# Altium schematic sheet IQ_AMP.SchDoc
size A; SheetNumber: 5; SheetTotal: 6
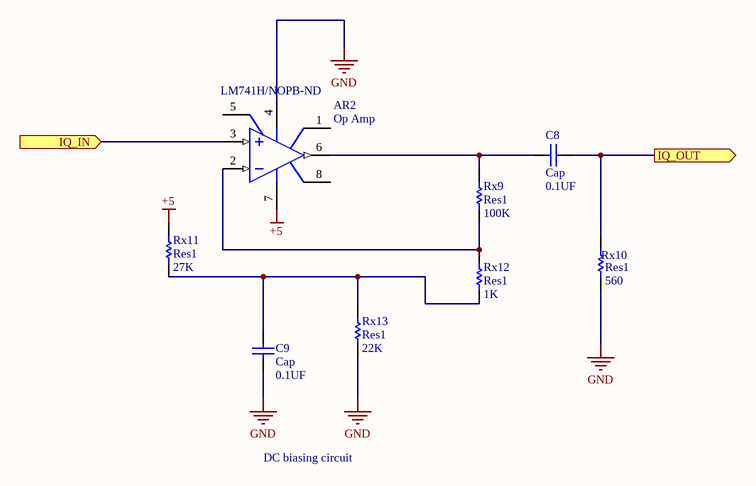
[diagram p0: IQ_AMP.SchDoc]

## Parts
AR2  Op Amp  Supplier Part Number 1: LM741H/NOPB-ND  [H-08A]
C8  Cap  value 0.1UF  [1206]
C9  Cap  value 0.1UF  [1206]
Rx9  Res1  value 100K  [AXIAL-0.1-RES]
Rx10  Res1  value 560  [AXIAL-0.1-RES]
Rx11  Res1  value 27K  [AXIAL-0.1-RES]
Rx12  Res1  value 1K  [AXIAL-0.1-RES]
Rx13  Res1  value 22K  [AXIAL-0.1-RES]

## Ports
IQ_IN (in), IQ_OUT (out)

## Nets
+5: AR2.7(V+) Rx11.2
GND: AR2.4(V-) C9.1 Rx10.1 Rx13.1
IQ_IN: AR2.3(IN+) ; port IQ_IN
IQ_OUT: C8.2 Rx10.2 ; port IQ_OUT
NetAR2_2: AR2.2(IN-) Rx9.1 Rx12.2
NetAR2_6: AR2.6(OUT) C8.1 Rx9.2
NetC9_2: C9.2 Rx11.1 Rx12.1 Rx13.2

Not connected (* = marked no-connect by the designer): AR2 1(OS_NUL) 5(OS_NUL) 8(TAB)

## Notes on the sheet
- DC biasing circuit

## Library data of the parts
AR2 = Op Amp: FET Operational Amplifier; Published: 8-Jun-2000; LatestRevisionDate: 17-Jul-2002; LatestRevisionNote: Re-released for DXP Platform.; DatasheetVersion: REV. B; PackageVersion: 1990; PackageReference: H-08A; Publisher: Altium Limited; PackageDescription: Can; 8 Leads; Pin Circle Dia. 5.08 mm; Lead Dia. 0.53 mm (max); ComponentLink1Description: Manufacturer Link; ComponentLink1URL: http://www.analog.com/; Supplier 1: Digi-Key
C8 C9 = CAP CER 0.1UF 50V X7R 1206: Capacitor; Manufacturer Part Number: 885012208087; Designator: C?; Voltage Rating: 50V; Published: 8-Jun-2000; LatestRevisionDate: 17-Jul-2002; LatestRevisionNote: Re-released for DXP Platform.; Publisher: Altium Limited
Rx9 = RES 100K OHM 5% 1/4W AXIAL: Resistor; Manufacturer Part Number: CFR-25JB-52-100K; Designator: R?; Power Rating: 1/4W; Tolerance: 0.05; Published: 8-Jun-2000; LatestRevisionDate: 17-Jul-2002; LatestRevisionNote: Re-released for DXP Platform.; Publisher: Altium Limited
Rx10 = RES 560 OHM 5% 1/4W AXIAL: Resistor; Manufacturer Part Number: CFR-25JB-52-560R; Designator: R?; Power Rating: 1/4W; Tolerance: 0.05; Published: 8-Jun-2000; LatestRevisionDate: 17-Jul-2002; LatestRevisionNote: Re-released for DXP Platform.; Publisher: Altium Limited
Rx11 = RES 27K OHM 5% 1/4W AXIAL: Resistor; Manufacturer Part Number: CFR-25JB-52-27K; Designator: R?; Power Rating: 1/4W; Tolerance: 0.05; Published: 8-Jun-2000; LatestRevisionDate: 17-Jul-2002; LatestRevisionNote: Re-released for DXP Platform.; Publisher: Altium Limited
Rx12 = RES 1K OHM 5% 1/4W AXIAL: Resistor; Manufacturer Part Number: CFR-25JB-52-1K; Designator: R?; Power Rating: 1/4W; Tolerance: 0.05; Published: 8-Jun-2000; LatestRevisionDate: 17-Jul-2002; LatestRevisionNote: Re-released for DXP Platform.; Publisher: Altium Limited
Rx13 = RES 22K OHM 5% 1/4W AXIAL: Resistor; Manufacturer Part Number: CFR-25JB-52-22K; Designator: R?; Power Rating: 1/4W; Tolerance: 0.05; Published: 8-Jun-2000; LatestRevisionDate: 17-Jul-2002; LatestRevisionNote: Re-released for DXP Platform.; Publisher: Altium Limited